# EAGLE design untitled_old (EAGLE 6.1)
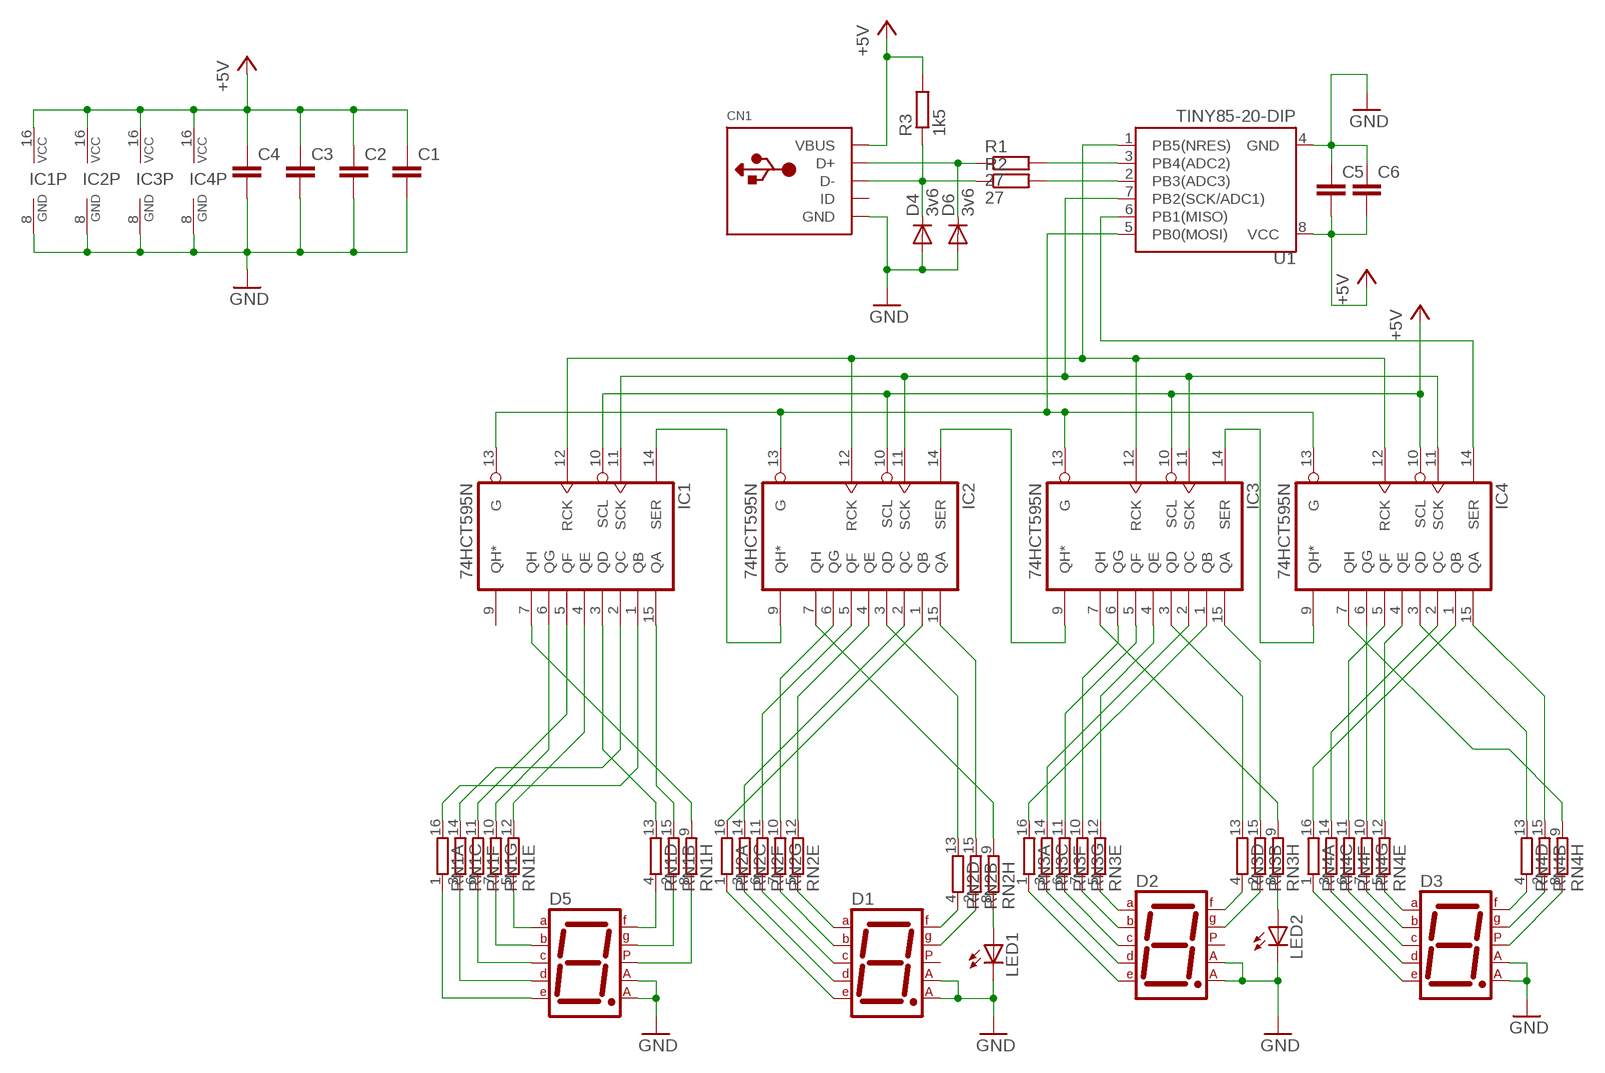
[diagram p0: schematic, sheet 1]

## Parts
C1  C-EU025-025X050  [C025-025X050]
C2  C-EU025-025X050  [C025-025X050]
C3  C-EU025-025X050  [C025-025X050]
C4  C-EU025-025X050  [C025-025X050]
C5  C-EU025-025X050  [C025-025X050]
C6  C-EU025-025X050  [C025-025X050]
CN1  USBTHM  [USB-MINIB-THM]
D1  7SEG-CA  [7SEG-13]
D2  7SEG-CA  [7SEG-13]
D3  7SEG-CA  [7SEG-13]
D4  3v6  DIODE-D-7.5  [D-7.5]
D5  7SEG-CA  [7SEG-13]
D6  3v6  DIODE-D-7.5  [D-7.5]
IC1  74HCT595N  [DIL16]
IC2  74HCT595N  [DIL16]
IC3  74HCT595N  [DIL16]
IC4  74HCT595N  [DIL16]
LED1  LED3MM  [LED3MM]
LED2  LED3MM  [LED3MM]
R1  27  R-EU_0204/7  [0204/7]
R2  27  R-EU_0204/7  [0204/7]
R3  1k5  R-EU_0204/7  [0204/7]
RN1  8R-N  [DIL16]
RN2  8R-N  [DIL16]
RN3  8R-N  [DIL16]
RN4  8R-N  [DIL16]
U1  TINY85-20-DIP  ATTINY45TINY85-20-DIP  [DIP08]

## Nets
+5V: C1.1 C2.1 C3.1 C4.1 C5.2 C6.2 CN1.VBUS IC1.10(SCL) IC1.16(VCC) IC2.10(SCL) IC2.16(VCC) IC3.10(SCL) IC3.16(VCC) IC4.10(SCL) IC4.16(VCC) R3.2 U1.8(VCC)
GND: C1.2 C2.2 C3.2 C4.2 C5.1 C6.1 CN1.GND D1.3(CA1) D1.8(CA2) D2.3(CA1) D2.8(CA2) D3.3(CA1) D3.8(CA2) D4.A D5.3(CA1) D5.8(CA2) D6.A IC1.8(GND) IC2.8(GND) IC3.8(GND) IC4.8(GND) LED1.K(C) LED2.K(C) U1.4(GND)
LAT: IC1.12(RCK) IC2.12(RCK) IC3.12(RCK) IC4.12(RCK) U1.1(PB5(NRES))
N$1: D1.7(A) RN2.5
N$2: D5.6(B) RN1.7
N$3: D5.4(C) RN1.6
N$4: D5.2(D) RN1.3
N$5: D5.1(E) RN1.1
N$6: D5.9(F) RN1.4
N$7: D5.10(G) RN1.2
N$8: D5.5(DP) RN1.8
N$9: D5.7(A) RN1.5
N$10: IC1.2(QC) RN1.14
N$11: IC1.5(QF) RN1.11
N$12: IC1.6(QG) RN1.10
N$13: IC1.4(QE) RN1.12
N$14: D1.6(B) RN2.7
N$15: IC1.1(QB) RN1.16
N$16: D1.4(C) RN2.6
N$17: IC1.7(QH) RN1.9
N$18: D1.2(D) RN2.3
N$19: D1.1(E) RN2.1
N$20: D1.9(F) RN2.4
N$21: IC1.3(QD) RN1.13
N$22: D1.10(G) RN2.2
N$23: IC2.1(QB) RN2.16
N$24: IC1.15(QA) RN1.15
N$25: IC2.2(QC) RN2.14
N$26: IC2.4(QE) RN2.12
N$27: IC2.6(QG) RN2.10
N$28: IC2.7(QH) RN2.9
N$29: IC2.15(QA) RN2.15
N$30: IC2.3(QD) RN2.13
N$31: IC2.5(QF) RN2.11
N$32: D2.7(A) RN3.5
N$33: D2.6(B) RN3.7
N$34: D2.4(C) RN3.6
N$35: D2.2(D) RN3.3
N$36: D2.1(E) RN3.1
N$37: D2.9(F) RN3.4
N$38: D2.10(G) RN3.2
N$39: IC3.15(QA) RN3.15
N$40: IC3.1(QB) RN3.16
N$41: IC3.2(QC) RN3.14
N$42: IC3.3(QD) RN3.13
N$43: IC3.7(QH) RN3.9
N$44: IC3.4(QE) RN3.12
N$45: IC3.5(QF) RN3.11
N$46: IC3.6(QG) RN3.10
N$47: D3.7(A) RN4.5
N$48: D3.6(B) RN4.7
N$49: D3.4(C) RN4.6
N$50: D3.2(D) RN4.3
N$51: D3.1(E) RN4.1
N$52: D3.9(F) RN4.4
N$53: D3.10(G) RN4.2
N$54: D3.5(DP) RN4.8
N$55: IC4.1(QB) RN4.16
N$56: IC4.15(QA) RN4.15
N$57: IC4.2(QC) RN4.14
N$58: IC4.5(QF) RN4.11
N$59: IC4.6(QG) RN4.10
N$60: IC4.4(QE) RN4.12
N$61: IC4.3(QD) RN4.13
N$62: IC4.7(QH) RN4.9
N$63: LED2.A RN3.8
N$64: LED1.A RN2.8
N$65: R1.2 U1.3(PB4(ADC2))
N$67: CN1.D- D4.C R2.1 R3.1
N$68: CN1.D+ D6.C R1.1
N$69: R2.2 U1.2(PB3(ADC3))
N$71: IC4.14(SER) U1.6(PB1(MISO))
N$72: IC3.14(SER) IC4.9(QH*)
N$73: IC2.14(SER) IC3.9(QH*)
N$74: IC1.14(SER) IC2.9(QH*)
N$75: IC1.13(G) IC2.13(G) IC3.13(G) IC4.13(G) U1.5(PB0(MOSI))
N$77: IC1.11(SCK) IC2.11(SCK) IC3.11(SCK) IC4.11(SCK) U1.7(PB2(SCK/ADC1))
Unconnected: CN1.ID D1.5(DP) D2.5(DP) IC1.9(QH*)

## Library data of the parts
C1-C6 = rcl:C-EU: CAPACITOR, European symbol
CN1 = adafruit:USB: USB Connectors USBMINIB - Surface Mount Female Mini-B USB Connector 4UConnector: 06564 By microbuilder.eu Thru-hole RA Female Mini-B USB Connector 4UConnector: 18732 By ladyada.net
D1-D3 D5 = special:7SEG-CA: 7-segment DISPLAY single anode, 13 mm
D4 D6 = diode:DIODE-: DIODE
IC1-IC4 = 74xx-eu:74*595: 8-bit SHIFT REGISTER, output latch
LED1 LED2 = led:LED: LED OSRAM: - CHIPLED LG R971, LG N971, LY N971, LG Q971, LY Q971, LO R971, LY R971 LH N974, LH R974 LS Q976, LO Q976, LY Q976 LO Q996 - Hyper CHIPLED LW Q18S LB Q993, LB Q99A, LB R99A - SideLED LS A670, LO A670, LY A670, LG A670, LP A670 LB A673, LV A673, LT A673, LW A673 LH A674 LY A675 LS A676, LA A676, LO A676, LY A676, LW A676 LS A679, LY A679, LG A679 - Hyper Micro SIDELED® LS Y876, LA Y876, LO Y876, LY Y876 LT Y87S - SmartLED LW L88C, LW L88S LB L89C, LB L89S, LG L890 LS L89K, LO L89K, LY L89K LS L896, LA L896, LO L896, LY L896 - TOPLED LS T670, LO T670, LY T670, LG T670, LP T670 LSG T670, LSP T670, LSY T670, LOP T670, LYG T670 LG T671, LOG T671, LSG T671 LB T673, LV T673, LT T673, LW T673 LH T674 LS T676, LA T676, LO T676, LY T676, LB T676, LH T676, LSB T676, LW T676 LB T67C, LV T67C, LT T67C, LS T67K, LO T67K, LY T67K, LW E67C LS E67B, LA E67B, LO E67B, LY E67B, LB E67C, LV E67C, LT E67C LW T67C LS T679, LY T679, LG T679 LS T770, LO T770, LY T770, LG T770, LP T770 LB T773, LV T773, LT T773, LW T773 LH T774 LS E675, LA E675, LY E675, LS T675 LS T776, LA T776, LO T776, LY T776, LB T776 LHGB T686 LT T68C, LB T68C - Hyper Mini TOPLED® LB M676 - Mini TOPLED Santana® LG M470 LS M47K, LO M47K, LY M47K Source: http://www.osram.convergy.de LUXEON: - LUMILED® LXK2-PW12-R00, LXK2-PW12-S00, LXK2-PW14-U00, LXK2-PW14-V00 LXK2-PM12-R00, LXK2-PM12-S00, LXK2-PM14-U00 LXK2-PE12-Q00, LXK2-PE12-R00, LXK2-PE12-S00, LXK2-PE14-T00, LXK2-PE14-U00 LXK2-PB12-K00, LXK2-PB12-L00, LXK2-PB12-M00, LXK2-PB14-N00, LXK2-PB14-P00, LXK2-PB14-Q00 LXK2-PR12-L00, LXK2-PR12-M00, LXK2-PR14-Q00, LXK2-PR14-R00 LXK2-PD12-Q00, LXK2-PD12-R00, LXK2-PD12-S00 LXK2-PH12-R00, LXK2-PH12-S00 LXK2-PL12-P00, LXK2-PL12-Q00, LXK2-PL12-R00 Source: www.luxeon.com KINGBRIGHT: KA-3528ASYC Source: www.kingbright.com
R1-R3 = rcl:R-EU_: RESISTOR, European symbol
RN1-RN4 = resistor-dil:8R-N: DIL RESISTOR; OC_FARNELL: unknown; OC_NEWARK: unknown
U1 = SparkFun-DigitalIC:ATTINY45: Atmel 8-pin 2/4/8kB flash uC; PROD_ID: IC-09445

## Board
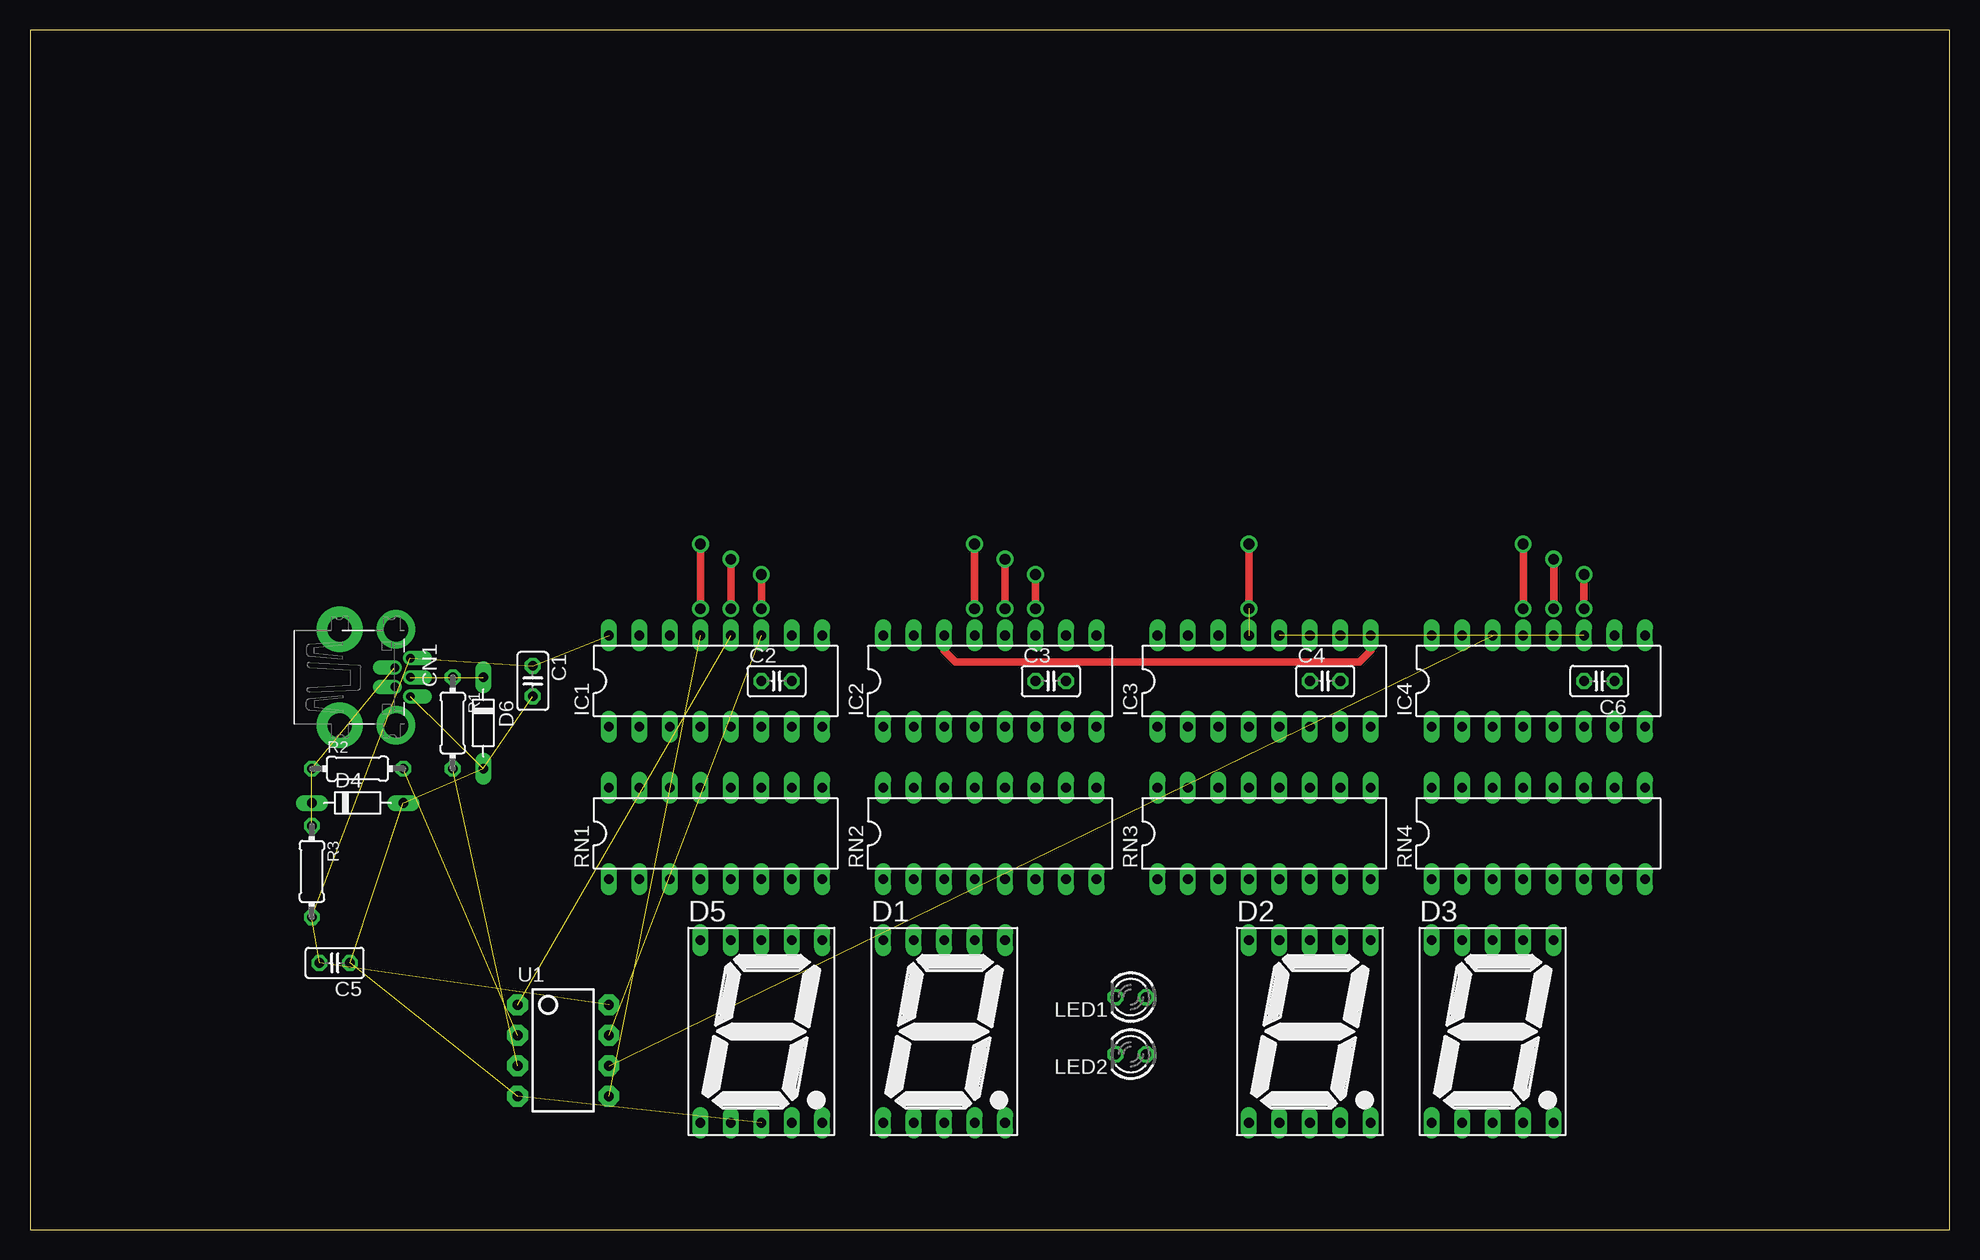
[diagram p1: board, top side]
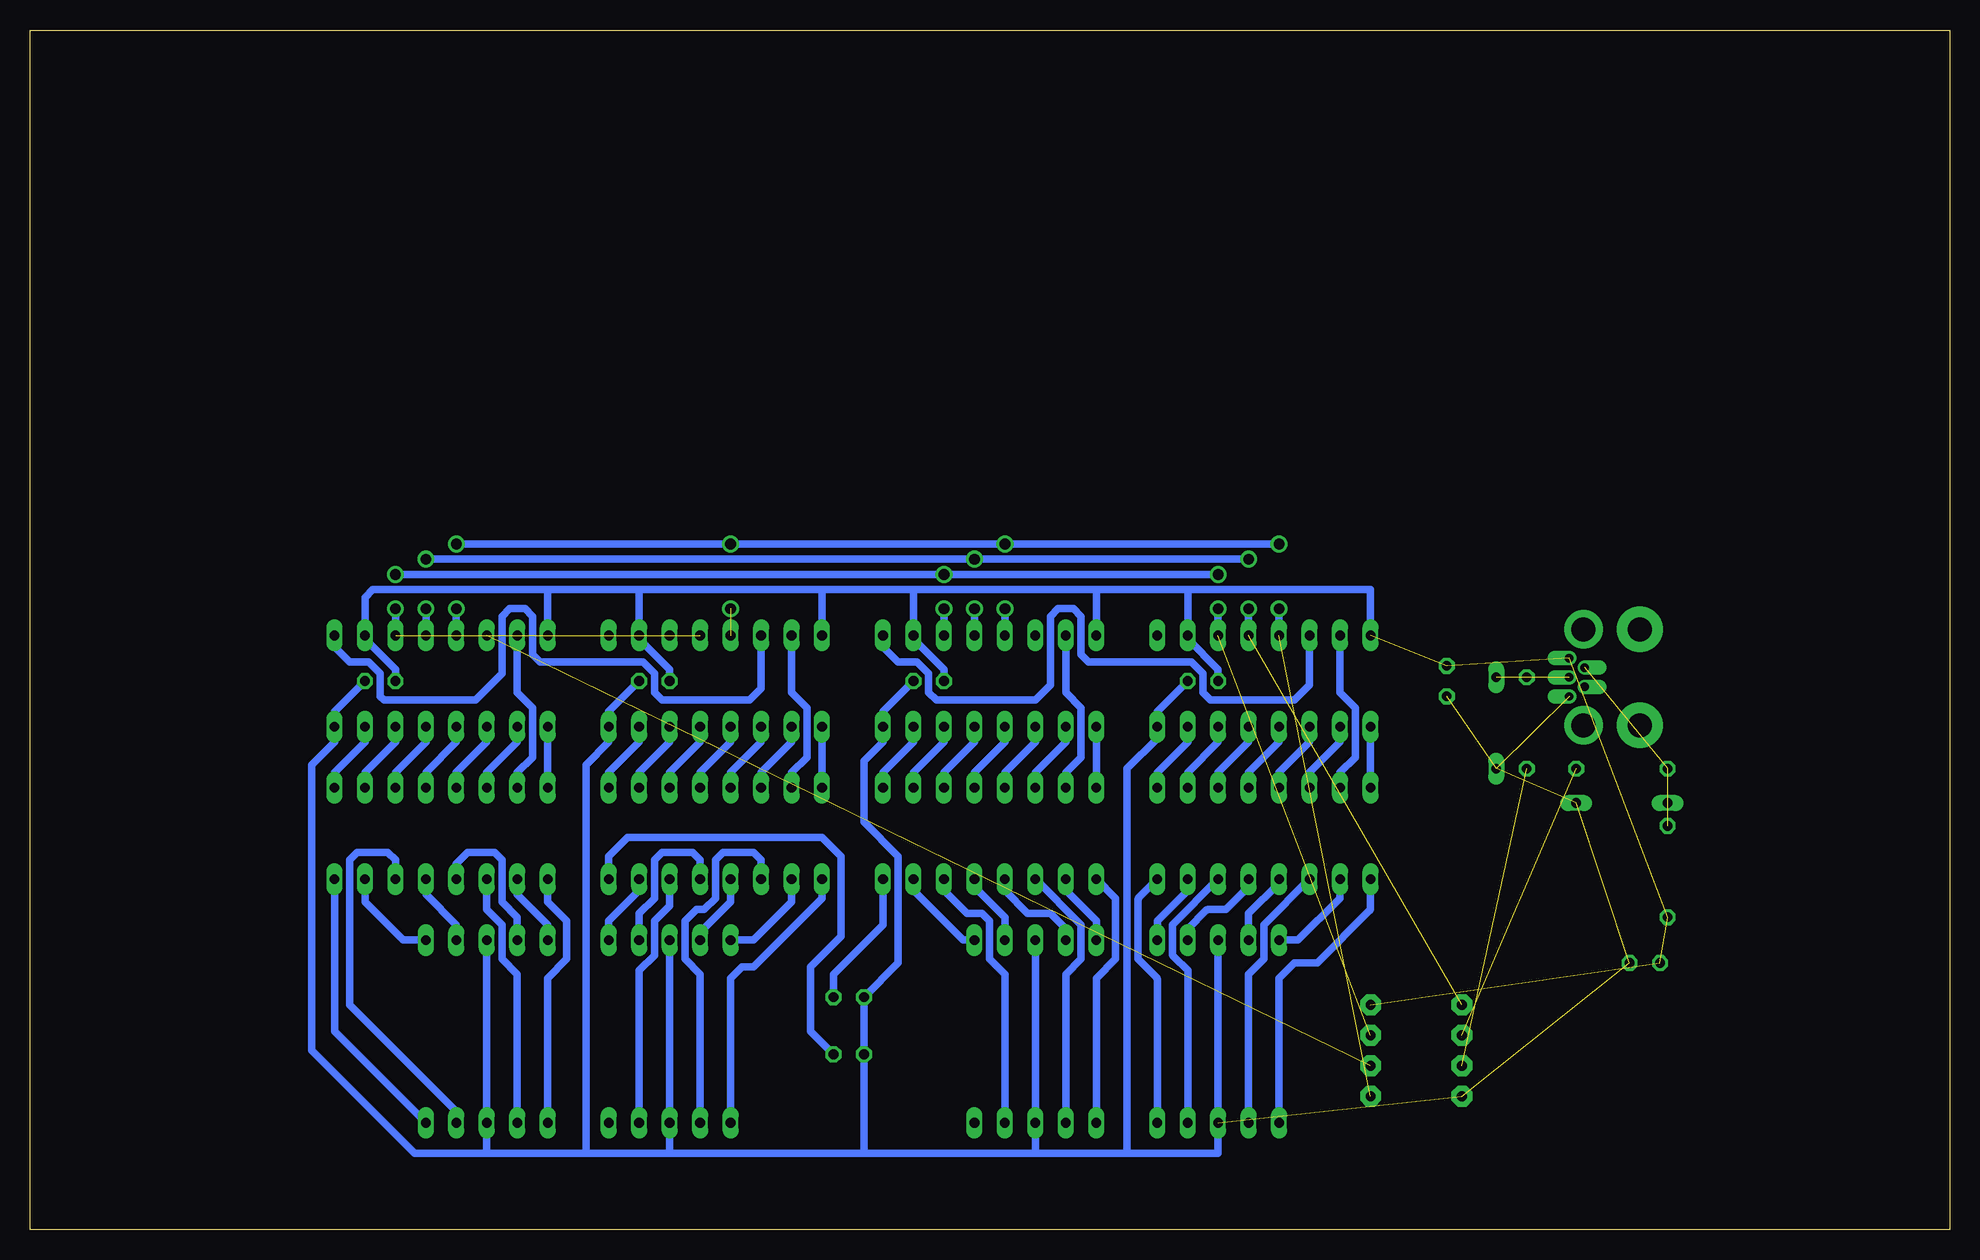
[diagram p2: board, bottom side, seen from below]

Size 160 x 100 mm. Coordinates in mm from the lower left corner, seen from the top.
Outline: 0,0 160,0 160,100 0,100 0,0
Copper layers (1*16): Top 0.035mm / dielectric 1.5mm / Bottom 0.035mm
Design rules: minimum track width 10mil, minimum drill 24mil, track to track 12mil, track to pad 12mil, pad to pad 12mil, via to via 12mil, smd to smd 10mil, copper to edge 12mil, drill to drill 12mil, minimum pad ring 10mil, minimum via ring 10mil, stop-mask expansion 4mil, vias tented up to drill 0mil, thermal gap 12mil

### Footprints (pad centres in the part's own frame; a part is rotated, then mirrored left to right if it is on the bottom)
C025-025X050 = drill 0.813 octagon: 1 -1.27,0; 2 1.27,0
USB-MINIB-THM = drill 0.7 offset: D+ 0,9.8; D- -0.8,8.5; GND 1.6,9.8; ID 0.8,8.5; VBUS -1.6,9.8 | drill 2 pad 3.81: GND1 -4,3.9; GND4 4,3.9 | drill 2 pad 3.2: GND2 -4,8.6; GND3 4,8.6
7SEG-13 = drill 0.813 long: 1 -5.08,-7.62; 2 -2.54,-7.62; 3 0,-7.62; 4 2.54,-7.62; 5 5.08,-7.62; 6 5.08,7.62; 7 2.54,7.62; 8 0,7.62; 9 -2.54,7.62; 10 -5.08,7.62
D-7.5 = drill 0.813 long: A 3.81,0; C -3.81,0
DIL16 = drill 0.813 long: 1 -8.89,-3.81; 2 -6.35,-3.81; 3 -3.81,-3.81; 4 -1.27,-3.81; 5 1.27,-3.81; 6 3.81,-3.81; 7 6.35,-3.81; 8 8.89,-3.81; 9 8.89,3.81; 10 6.35,3.81; 11 3.81,3.81; 12 1.27,3.81; 13 -1.27,3.81; 14 -3.81,3.81; 15 -6.35,3.81; 16 -8.89,3.81
LED3MM = drill 0.813 octagon: A -1.27,0; K 1.27,0
0204/7 = drill 0.813 octagon: 1 -3.81,0; 2 3.81,0
DIP08 = drill 0.813 pad 1.727 octagon: 1 -3.81,-3.81; 2 -1.27,-3.81; 3 1.27,-3.81; 4 3.81,-3.81; 5 3.81,3.81; 6 1.27,3.81; 7 -1.27,3.81; 8 -3.81,3.81

### Placement (x,y rotation side)
C1  41.91,45.72 270 top
C2  62.23,45.72 0 top
C3  85.09,45.72 0 top
C4  107.95,45.72 0 top
C5  25.4,22.23 180 top
C6  130.81,45.72 180 top
CN1  21.91,46.04 270 top
D1  76.2,16.51 0 top
D2  106.68,16.51 0 top
D3  121.92,16.51 0 top
D4  27.3,35.56 0 top
D5  60.96,16.51 0 top
D6  37.78,42.23 270 top
IC1  57.15,45.72 0 top
IC2  80.01,45.72 0 top
IC3  102.87,45.72 0 top
IC4  125.73,45.72 0 top
LED1  91.76,19.37 180 top
LED2  91.76,14.61 180 top
R1  35.24,42.23 270 top
R2  27.3,38.42 0 top
R3  23.5,29.84 270 top
RN1  57.15,33.02 0 top
RN2  80.01,33.02 0 top
RN3  102.87,33.02 0 top
RN4  125.73,33.02 0 top
U1  44.45,14.92 270 top

### Tracks (layer width: path | path; a pad name or v marks a point on that pad's centre or on a via)
+5V  (5 unrouted)
  Bottom 0.61: IC1.16 48.26,53.34 63.5,53.34 | 63.5,53.34 71.12,53.34 | IC2.16 71.12,53.34 | 71.12,53.34 86.36,53.34 | 86.36,53.34 IC2.10 86.36,49.21 83.82,46.67 C3.1 | 93.98,53.34 86.36,53.34 | IC3.16 93.98,53.34 | 93.98,53.34 109.22,53.34 | 109.22,53.34 116.84,53.34 | 116.84,53.34 131.44,53.34 132.08,52.7 IC4.10 132.08,49.21 129.54,46.67 C6.2 | IC4.16 116.84,53.34 | 109.22,53.34 IC3.10 109.22,49.21 106.68,46.67 C4.1 | C2.1 60.96,46.67 63.5,49.21 IC1.10 63.5,53.34
GND  (6 unrouted)
  Bottom 0.61: 76.2,6.35 D1.3 D1.8 | 90.49,6.35 LED2.K LED1.K 87.63,22.23 87.63,31.11 90.49,33.97 90.49,39.05 88.9,40.64 IC2.8 88.9,43.18 C3.2 | 90.49,6.35 106.68,6.35 | 106.68,6.35 D2.3 D2.8 | 90.49,6.35 76.2,6.35 | 76.2,6.35 68.58,6.35 | 68.58,6.35 60.96,6.35 D5.3 D5.8 | 121.92,6.35 D3.3 D3.8 | 121.92,6.35 113.67,6.35 | 113.67,6.35 106.68,6.35 | C2.2 66.04,43.18 IC1.8 66.04,40.96 68.58,38.42 68.58,6.35 | C4.2 111.76,43.18 IC3.8 111.76,40.64 113.67,38.73 113.67,6.35 | C6.1 134.62,43.18 IC4.8 134.62,40.64 136.53,38.73 136.53,14.92 127.95,6.35 121.92,6.35
LAT  (via drill 0.9)  (2 unrouted)
  Top 0.61: v58.42,51.75 v58.42,55.88 | v127,55.88 v127,51.75 | v81.28,51.75 v81.28,55.88
  Bottom 0.61: IC1.12 v58.42,51.75 | v58.42,55.88 80.96,55.88 v81.28,55.88 v127,55.88 | v127,51.75 IC4.12 | IC2.12 v81.28,51.75
N$1
  Bottom 0.61: D1.7 78.74,26.04 81.28,28.57 RN2.5
N$2
  Bottom 0.61: RN1.7 63.5,28.36 arc45 63.57,28.18 66.04,25.72 D5.6
N$3
  Bottom 0.61: RN1.6 64.77,25.4 64.77,22.96 arc-45 64.7,22.79 63.5,21.59 D5.4
N$4
  Bottom 0.61: RN1.3 57.15,25.4 57.15,22.65 arc45 57.22,22.47 58.42,21.27 D5.2
N$5
  Bottom 0.61: RN1.1 48.26,26.77 arc45 48.33,26.6 52.7,22.23 54.51,22.23 arc-45 54.68,22.15 55.88,20.95 D5.1
N$6
  Bottom 0.61: RN1.4 55.88,29 arc45 55.95,28.82 58.42,26.35 D5.9
N$7
  Bottom 0.61: RN1.2 50.8,27.73 arc45 50.87,27.55 54.29,24.13 D5.10
N$8
  Bottom 0.61: D5.5 66.04,20.85 arc-45 66.11,21.03 67.63,22.54 67.63,27.52 arc45 67.55,27.7 RN1.8
N$9
  Bottom 0.61: RN1.5 58.42,28.68 arc45 58.49,28.5 60.33,26.67 61.81,26.67 arc-45 61.99,26.6 63.5,25.08 D5.7
N$10
  Bottom 0.61: IC1.2 50.8,40.64 53.34,38.1 RN1.14
N$11
  Bottom 0.61: IC1.5 58.42,40.64 60.96,38.1 RN1.11
N$12
  Bottom 0.61: IC1.6 60.96,40.64 63.5,38.1 RN1.10
N$13
  Bottom 0.61: IC1.4 55.88,40.64 58.42,38.1 RN1.12
N$14
  Bottom 0.61: D1.6 82.23,24.13 86.36,28.26 RN2.7
N$15
  Bottom 0.61: IC1.1 RN1.16
N$16
  Bottom 0.61: RN2.6 83.82,28.26 81.92,26.35 80.64,26.35 80.01,25.72 80.01,22.54 78.74,21.27 D1.4
N$17
  Bottom 0.61: IC1.7 63.5,40.64 66.04,38.1 RN1.9
N$18
  Bottom 0.61: RN2.3 72.39,25.4 72.39,22.54 73.66,21.27 D1.2
N$19
  Bottom 0.61: D1.1 71.12,20.95 69.53,22.54 69.53,27.62 RN2.1
N$20
  Bottom 0.61: D1.9 73.66,25.08 74.93,26.35 76.83,26.35 78.74,28.26 RN2.4
N$21
  Bottom 0.61: IC1.3 53.34,40.64 55.88,38.1 RN1.13
N$22
  Bottom 0.61: D1.10 71.12,25.72 73.66,28.26 RN2.2
N$23
  Bottom 0.61: IC2.1 RN2.16
N$24
  Bottom 0.61: IC1.15 50.8,44.77 49.53,43.5 49.53,39.37 50.8,38.1 RN1.15
N$25
  Bottom 0.61: IC2.2 73.66,40.64 76.2,38.1 RN2.14
N$26
  Bottom 0.61: IC2.4 78.74,40.64 81.28,38.1 RN2.12
N$27
  Bottom 0.61: IC2.6 83.82,40.64 86.36,38.1 RN2.10
N$28
  Bottom 0.61: IC2.7 86.36,40.64 88.9,38.1 RN2.9
N$29
  Bottom 0.61: IC2.15 73.66,44.77 72.39,43.5 72.39,39.37 73.66,38.1 RN2.15
N$30
  Bottom 0.61: IC2.3 76.2,40.64 78.74,38.1 RN2.13
N$31
  Bottom 0.61: IC2.5 81.28,40.64 83.82,38.1 RN2.11
N$32
  Bottom 0.61: D2.7 109.22,26.35 107.95,27.62 107.95,30.8 107.31,31.43 104.78,31.43 104.14,30.8 RN3.5
N$33
  Bottom 0.61: D2.6 111.76,25.72 109.22,28.26 RN3.7
N$34
  Bottom 0.61: RN3.6 106.68,26.99 107.95,25.72 107.95,22.86 109.22,21.59 D2.4
N$35
  Bottom 0.61: RN3.3 99.06,30.8 99.69,31.43 102.23,31.43 102.87,30.8 102.87,27.62 103.82,26.67 104.46,26.67 105.41,25.72 105.41,22.54 104.14,21.27 D2.2
N$36
  Bottom 0.61: RN3.1 93.98,27.62 99.69,21.91 100.65,21.91 101.6,20.95 D2.1
N$37
  Bottom 0.61: RN3.4 101.6,27.3 104.14,24.77 D2.9
N$38
  Bottom 0.61: RN3.2 96.52,27.3 99.69,24.13 D2.10
N$39
  Bottom 0.61: IC3.15 96.52,44.77 95.25,43.5 95.25,39.37 96.52,38.1 RN3.15
N$40
  Bottom 0.61: IC3.1 RN3.16
N$41
  Bottom 0.61: IC3.2 96.52,40.64 99.06,38.1 RN3.14
N$42
  Bottom 0.61: IC3.3 99.06,40.64 101.6,38.1 RN3.13
N$43
  Bottom 0.61: IC3.7 109.22,40.64 111.76,38.1 RN3.9
N$44
  Bottom 0.61: IC3.4 101.6,40.64 104.14,38.1 RN3.12
N$45
  Bottom 0.61: IC3.5 104.14,40.64 106.68,38.1 RN3.11
N$46
  Bottom 0.61: IC3.6 106.68,40.64 109.22,38.1 RN3.10
N$47
  Bottom 0.61: RN4.5 127,27.94 124.46,25.4 D3.7
N$48
  Bottom 0.61: D3.6 128.91,24.13 132.08,27.3 RN4.7
N$49
  Bottom 0.61: D3.4 124.46,9.84 133.35,18.73 133.35,30.8 132.72,31.43 130.18,31.43 129.54,30.8 RN4.6
N$50
  Bottom 0.61: RN4.3 121.92,26.67 120.65,25.4 120.65,22.54 119.38,21.27 D3.2
N$51
  Bottom 0.61: RN4.1 116.84,27.3 115.25,25.72 115.25,22.54 116.84,20.95 D3.1
N$52
  Bottom 0.61: RN4.4 124.46,30.48 123.51,31.43 121.28,31.43 120.65,30.8 120.65,27.3 119.38,26.04 D3.9
N$53
  Bottom 0.61: RN4.2 119.38,27.94 116.84,25.4 D3.10
N$54
  Bottom 0.61: D3.5 134.62,16.51 RN4.8
N$55
  Bottom 0.61: IC4.1 RN4.16
N$56
  Bottom 0.61: RN4.15 119.38,38.1 118.11,39.37 118.11,43.5 119.38,44.77 IC4.15
N$57
  Bottom 0.61: IC4.2 119.38,40.64 121.92,38.1 RN4.14
N$58
  Bottom 0.61: IC4.5 127,40.64 129.54,38.1 RN4.11
N$59
  Bottom 0.61: IC4.6 129.54,40.64 132.08,38.1 RN4.10
N$60
  Bottom 0.61: IC4.4 124.46,40.64 127,38.1 RN4.12
N$61
  Bottom 0.61: IC4.3 121.92,40.64 124.46,38.1 RN4.13
N$62
  Bottom 0.61: IC4.7 132.08,40.64 134.62,38.1 RN4.9
N$63
  Bottom 0.61: RN3.8 111.76,31.11 110.17,32.7 93.98,32.7 92.39,31.11 92.39,24.45 94.93,21.91 94.93,16.51 LED2.A
N$64
  Bottom 0.61: LED1.A 93.03,21.27 88.9,25.4 RN2.8
N$65  (1 unrouted)
N$67  (3 unrouted)
N$68  (2 unrouted)
N$69  (1 unrouted)
N$71  (1 unrouted)
N$72
  Bottom 0.61: IC4.9 134.62,48.58 133.35,47.31 131.76,47.31 130.81,46.35 130.81,44.45 130.49,44.13 122.87,44.13 120.65,46.35 120.65,51.12 120.02,51.75 118.75,51.75 118.11,51.12 118.11,47.94 117.47,47.31 108.9,47.31 107.95,46.35 107.95,44.77 107.31,44.13 100.01,44.13 99.06,45.09 IC3.14
N$73
  Top 0.61: IC2.14 76.2,48.26 77.15,47.31 110.81,47.31 111.76,48.26 IC3.9
N$74
  Bottom 0.61: IC1.14 53.34,45.4 54.61,44.13 61.59,44.13 62.23,44.77 62.23,46.35 63.18,47.31 71.75,47.31 72.39,47.94 72.39,51.12 73.03,51.75 74.3,51.75 74.93,51.12 74.93,45.4 76.2,44.13 84.45,44.13 85.09,44.77 85.09,46.35 86.04,47.31 87.63,47.31 88.9,48.58 IC2.9
N$75  (via drill 0.9)  (2 unrouted)
  Top 0.61: v55.88,51.75 v55.88,57.15 | v124.46,57.15 v124.46,51.75 | v78.74,51.75 v78.74,57.15 | v101.6,57.15 v101.6,51.75
  Bottom 0.61: IC1.13 v55.88,51.75 | v55.88,57.15 v78.74,57.15 v101.6,57.15 v124.46,57.15 | v124.46,51.75 IC4.13 | IC2.13 v78.74,51.75
N$77  (via drill 0.9)  (2 unrouted)
  Top 0.61: v60.96,51.75 v60.96,54.61 | v129.54,54.61 v129.54,51.75 | v83.82,51.75 v83.82,54.61
  Bottom 0.61: IC1.11 v60.96,51.75 | v60.96,54.61 v83.82,54.61 84.14,54.61 v129.54,54.61 | v129.54,51.75 IC4.11 | IC2.11 v83.82,51.75